# Altium schematic sheet Cortex CLK_SWD_USB_ADC.SchDoc: LPC4337 - CLK/SWD/USB1
size A4; Author: Andreas Rehn; CompanyName: Hochschule Ulm; DrawnBy: Andreas Rehn; Engineer: Andreas Rehn; Organization: Hochschule Ulm; Address1: Institut für Medizintechnik; Address2: und Mechatronik; Address3: Albert-Einstein-Allee 55; Address4: 89081 Ulm; SheetNumber: 9; SheetTotal: 11
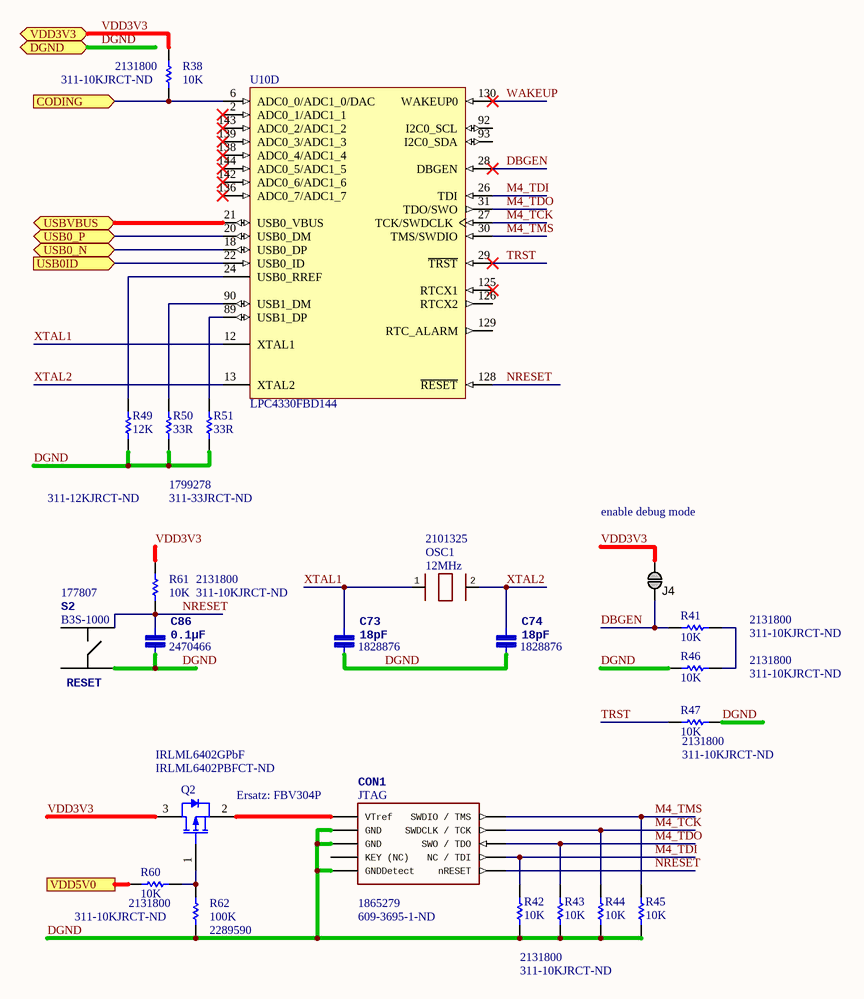
[diagram p0: Cortex CLK_SWD_USB_ADC.SchDoc]

## Parts
C73  18pF  Supplier Part Number 1: 1828876  [0402[1005]]
C74  18pF  Supplier Part Number 1: 1828876  [0402[1005]]
C86  0.1µF  Supplier Part Number 1: 2470466  [0402[1005]]
CON1  JTAG  Supplier Part Number 1: 609-3695-1-ND  Supplier Part Number 2: 1865279  [SWD-10-SMD]
J4  Jumper  [JUMP1]  (value not drawn)  (no BOM)
OSC1  12MHz  Supplier Part Number 1: 2101325  [CRYSTAL_HC49-US-SM]
Q2  IRLML6402GPbF  Supplier Part Number 1: IRLML6402PBFCT-ND  [INTR-SOT-23-3_V]
R38  10K  Supplier Part Number 1: 311-10KJRCT-ND  Supplier Part Number 2: 2131800  [0402[1005]]
R41  10K  Supplier Part Number 1: 311-10KJRCT-ND  Supplier Part Number 2: 2131800  [0402[1005]]
R42  10K  Supplier Part Number 1: 311-10KJRCT-ND  Supplier Part Number 2: 2131800  [0402[1005]]
R43  10K  [0402[1005]]
R44  10K  [0402[1005]]
R45  10K  [0402[1005]]
R46  10K  Supplier Part Number 1: 311-10KJRCT-ND  Supplier Part Number 2: 2131800  [0402[1005]]
R47  10K  Supplier Part Number 1: 311-10KJRCT-ND  Supplier Part Number 2: 2131800  [0402[1005]]
R49  12K  Supplier Part Number 1: 311-12KJRCT-ND  [0402[1005]]
R50  33R  Supplier Part Number 1: 311-33JRCT-ND  Supplier Part Number 2: 1799278  [0402[1005]]
R51  33R  [0402[1005]]
R60  10K  Supplier Part Number 1: 311-10KJRCT-ND  Supplier Part Number 2: 2131800  [0402[1005]]
R61  10K  Supplier Part Number 1: 311-10KJRCT-ND  Supplier Part Number 2: 2131800  [0402[1005]]
R62  100K  Supplier Part Number 1: 2289590  [0402[1005]]
S2  RESET  value B3S-1000  Supplier Part Number 1: 177807  [Omron B3S1000]
U10  LPC4330FBD144  [LQFP144]  (part D of 5)

## Ports
CODING (in), DGND, USB0_N (bidir), USB0_P (bidir), USB0ID (in), USBVBUS (bidir), VDD3V3, VDD5V0

## Nets
CODING: R38.2 U10.6(ADC0_0/ADC1_0/DAC) ; port CODING
DBGEN: J4.2 R41.1 U10.28(DBGEN)
DGND: C73.2(P$2) C74.2(P$2) C86.2(P$2) CON1.GND CON1.GNDDetect R42.2 R43.2 R44.2 R45.2 R46.2 R47.2 R49.2 R50.2 R51.2 R62.1 S2.1 ; port DGND
M4_TCK: CON1.TCK(SWDCLK_/_TCK) R44.1 U10.27(TCK/SWDCLK)
M4_TDI: CON1.TDI(NC_/_TDI) R42.1 U10.26(TDI)
M4_TDO: CON1.TDO(SWO_/_TDO) R43.1 U10.31(TDO/SWO)
M4_TMS: CON1.TMS(SWDIO_/_TMS) R45.1 U10.30(TMS/SWDIO)
NRESET: C86.1(P$1) CON1.nRESET R61.2 S2.3 U10.128(~{RESET})
TRST: R47.1 U10.29(~{TRST})
USB0_N: U10.18(USB0_DP) ; port USB0_N
USB0_P: U10.20(USB0_DM) ; port USB0_P
USB0ID: U10.22(USB0_ID) ; port USB0ID
USBVBUS: U10.21(USB0_VBUS) ; port USBVBUS
VDD3V3: J4.1 Q2.3(D) R38.1 R61.1 ; port VDD3V3
VDD5V0: R60.1 ; port VDD5V0
WAKEUP: U10.130(WAKEUP0)
XTAL1: C73.1(P$1) OSC1.1 U10.12(XTAL1)
XTAL2: C74.1(P$1) OSC1.2 U10.13(XTAL2)
NetCON1_VTref: CON1.VTref Q2.2(S)
NetQ2_1: Q2.1(G) R60.2 R62.2
NetR41_2: R41.2 R46.1
NetR49_1: R49.1 U10.24(USB0_RREF)
NetR50_1: R50.1 U10.90(USB1_DM)
NetR51_1: R51.1 U10.89(USB1_DP)

Not connected (* = marked no-connect by the designer): CON1 KEY(KEY_(NC)); S2 2 4; U10 2(ADC0_1/ADC1_1)* 92(I2C0_SCL) 93(I2C0_SDA) 125(RTCX1)* 126(RTCX2) 129(RTC_ALARM) 136(ADC0_7/ADC1_7)* 138(ADC0_4/ADC1_4)* 139(ADC0_3/ADC1_3)* 142(ADC0_6/ADC1_6)* 143(ADC0_2/ADC1_2)* 144(ADC0_5/ADC1_5)*

## Notes on the sheet
- enable debug mode
- Ersatz: FBV304P
- Project
- Ultrasonic Doppler 2015
- Title
- Size:
- Date:
- A4
- Number:
- Time:
- Revision:
- Sheet
- of
- Eng:

## Library data of the parts
C73 C74 C86 = Capacitor: Cap; Supplier 1: Farnell
  C73 C74: value: 18pF
  C86: value: 0.1µF
CON1 = SWD-10_SMD: Supplier 1: Digi-Key; Supplier 2: Farnell
J4 = JUMP1: SMD jumper
OSC1 = Crystal 2PIN: Resonator; value: 12MHz; Supplier 1: Farnell
Q2 = CMP-0676-00001-1: HEXFET Power MOSFET, P-Channel, -20 V VDSS, 0.065 Ohm RDS, 3-Pin SOT23, RoHS, Tape and Reel; Manufacturer: International Rectifier; ISM (Max.): -22 A; QRR (Typ.): 11 nC; VSD (Max.): -1.2 V; IS (Max.): -1.3 A; VGS(TH): -0.4 to -1.2 V; V(BR)DSS (Min.): -20 V; TRR (Typ.): 29 ns; RDS (on): 0.065 Ohm; PartNumber: IRLML6402GPbF; Mounting Technology: Surface Mount; PackageReference: SOT-23-3; ComponentLink3URL: http://www.irf.com/product-info/datasheets/data/irlml6402gpbf.pdf; ComponentLink2URL: http://www.irf.com/product-info/datasheets/data/irlml6402gpbf.pdf; PackageDescription: 3-Pin SOT23, Body 2.92 x 1.3 mm, Pitch 1.9 mm; Packing: Tape and Reel; DatasheetVersion: 12/14/2011; ComponentLink1URL: http://www.irf.com/; ComponentLink3Description: Package Specification; ComponentLink2Description: Datasheet; RoHS: TRUE; ComponentLink1Description: Manufacturer URL; Supplier 1: Digi-Key
R38 R41-R47 R49-R51 R60-R62 = Resistor: Published: 8-Jun-2000; LatestRevisionDate: 17-Jul-2002; LatestRevisionNote: Re-released for DXP Platform.; PackageReference: AXIAL-0.3; Publisher: Altium Limited; PackageDescription: Axial Device, Thru-Hole; 2 Leads; 0.3 in Pin Spacing
  R38 R41 R42 R46 R47 R60 R61: Value: 10K; Supplier 1: Digi-Key; Supplier 2: Farnell
  R43-R45: Value: 10K; Supplier 1: Digi-Key; Supplier Part Number 1: 311-10KJRCT-ND; Supplier 2: Farnell; Supplier Part Number 2: 2131800
  R49: Value: 12K; Supplier 1: Digi-Key
  R50: Value: 33R; Supplier 1: Digi-Key; Supplier 2: Farnell
  R51: Value: 33R; Supplier 1: Digi-Key; Supplier Part Number 1: 311-33JRCT-ND; Supplier 2: Farnell; Supplier Part Number 2: 1799278
  R62: Value: 100K; Supplier 1: Farnell
S2 = B3S-1000: Sealed Tactile Switch (SMT); Supplier 1: Farnell
U10 = LPC4330FBD144: 32-bit ARM Cortex-M4 MCU, 264 kB SRAM, 2 HS USB with on-chip PHY, Ethernet, CAN, AES, SPIFI, SGPIO, SCT, 144-Pin LQFP; fmax: 204 MHz; GPIOs: 83; SRAM: 264 kB; ROM: 64 kB; Ethernet: Y; USB: 2; ADC channels: 8; SPI: 1; UART: 4; VDD (min): 2.2 V; VDD (max): 3.6 V; Code_IEC: 136E23; DatasheetVersion: Rev.3.1, Jan-2012; PackageVersion: Feb-2003; PackageReference: SOT486-1; PackageDescription: LQFP144: Plastic Low Profile Quad Flat Package; 144 Leads; Body 20 x 20 x 1.4 mm; PWM: Y; PLL: Y; I2C: 2; CAN: 2; Timers: 4; Code_JEDEC: MS-026; ComponentLink1Description: Manufacturer URL; ComponentLink1URL: http://www.nxp.com/; ComponentLink2Description: Datasheet; ComponentLink2URL: http://www.nxp.com/documents/data_sheet/LPC4350_30_20_10.pdf